# Altium schematic sheet HM-10.schDoc: HM-10 (BLE) Wiring
size A; Date: 3/13/2021; Author: Jesse Fernandez; CompanyName: GVSU; DrawnBy: Jesse Fernandez; Organization: Kennedy Hall of Engineering; Address1: 301 Fulton St. W; Address2: Grand Rapids, MI 49504; DocumentNumber: 1; Revision: 0.1; SheetNumber: 6; SheetTotal: 7; Time: 5:42 am
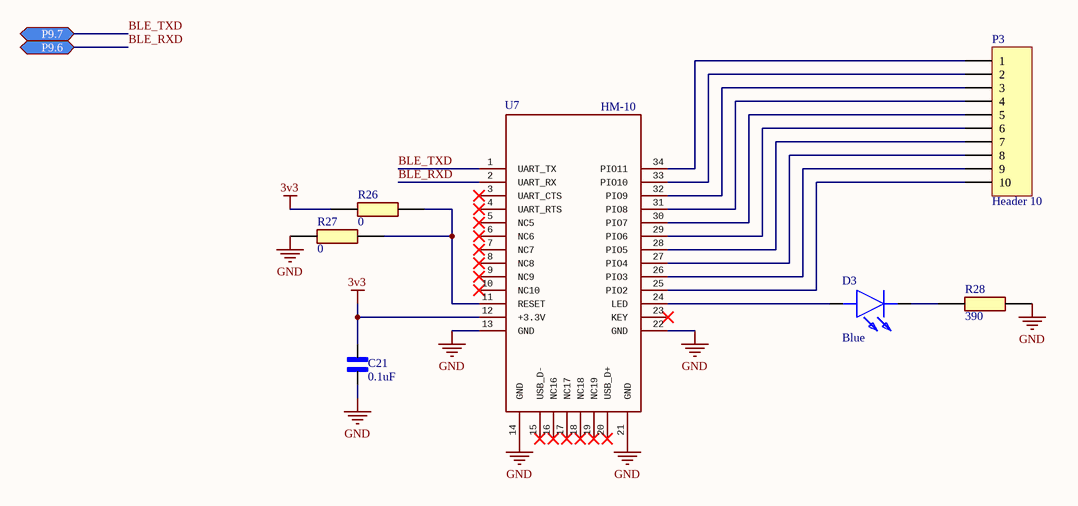
[diagram p0: HM-10.schDoc]

## Parts
C21  value 0.1uF  [CAPC1005X55N]  (hidden comment: Multilayer Ceramic Cap. 0402 (1005 Metric))
D3  Color: Blue  [APHHS1005LQBC/D-V]  (hidden comment: APHHS1005LQBC/D-V)
P3  Header 10  [HDR1X10]
R26  value 0  [Resistor 0603]  (hidden comment: Resistor 0603)
R27  value 0  [Resistor 0603]  (hidden comment: Resistor 0603)
R28  value 390  [Thin-Film Resistor 0402 (1005 Metric)]  (hidden comment: Resistor 0402 (1005 Metric))
U7  HM-10  [HM-10]

## Ports
P9.6 (bidir), P9.7 (bidir)

## Nets
3v3: C21.2 R26.1 U7.12(+3.3V)
GND: C21.1 R27.1 R28.2 U7.13(GND) U7.14(GND) U7.21(GND) U7.22(GND)
BLE_RXD: U7.2(UART_RX) ; port P9.6
BLE_TXD: U7.1(UART_TX) ; port P9.7
NetD3_1: D3.1(K) R28.1
NetD3_2: D3.2(A) U7.24(LED)
NetP3_1: P3.1 U7.34(PIO11)
NetP3_2: P3.2 U7.33(PIO10)
NetP3_3: P3.3 U7.32(PIO9)
NetP3_4: P3.4 U7.31(PIO8)
NetP3_5: P3.5 U7.30(PIO7)
NetP3_6: P3.6 U7.29(PIO6)
NetP3_7: P3.7 U7.28(PIO5)
NetP3_8: P3.8 U7.27(PIO4)
NetP3_9: P3.9 U7.26(PIO3)
NetP3_10: P3.10 U7.25(PIO2)
NetR26_2: R26.2 R27.2 U7.11(RESET)

Not connected (* = marked no-connect by the designer): U7 3(UART_CTS)* 4(UART_RTS)* 5(NC5)* 6(NC6)* 7(NC7)* 8(NC8)* 9(NC9)* 10(NC10)* 15(USB_D-)* 16(NC16)* 17(NC17)* 18(NC18)* 19(NC19)* 20(USB_D+)* 23(KEY)*

## Notes on the sheet
- Title
- Size:
- Date:
- A
- Number:
- Time:
- Revision:
- Sheet
- of
- Engineer:
- File:

## Library data of the parts
C21 = Multilayer Ceramic Cap. 0402 (1005 Metric): Capacitor X7R 0402 (1005 Metric); Manufacturer: AVX; Manufacturer P/N: 0402YC104JAT2A; Vendor: Mouser; Vendor P/N: 581-0402YC104JAT2A; Tolerance: 5%; Price: $0.72; ComponentLink1Description: Datasheet; ComponentLink1URL: *
D3 = APHHS1005LQBC/D-V: BLUE - Standard LEDs - SMD 1.0X0.5MM; Manufacturer: Kingbright; Vendor: Mouser; Vendor P/N: 604-APHHS1005LQBC/DV; V_forward: 2.65 [V]; I_forward: 2 [mA]; Manufacturer P/N: APHHS1005LQBC/D-V; Price: $0.56; ComponentLink1Description: Datasheet; ComponentLink1URL: https://www.mouser.com/datasheet/2/216/APHHS1005LQBC_D_V-1660377.pdf
P3 = Header 10: Header, 10-Pin; LatestRevisionDate: 17-Jul-2002; LatestRevisionNote: Re-released for DXP Platform.; Publisher: Altium Limited
R26 R27 = Resistor 0603: Manufacturer: Vishay / Dale; Manufacturer P/N: CRCW06030000Z0EA; Vendor: Mouser; Vendor P/N: 71-CRCW0603-0-E3; Tolerance: *tolerance*; Price: $0.10
R28 = Resistor 0402 (1005 Metric): Resistor, 0402 Package size; Manufacturer: Yageo; Manfacturer P/N: RC0402FR-07390RL; Vendor: Mouser; Vendor P/N: 603-RC0402FR-07390RL; Tolerance: 1%; Price: $0.10; ComponentLink1Description: Datasheet; ComponentLink1URL: *
U7 = HM-10: BLE Communication module, send/receive communications via UART; Manufacturer: DSD Tech; Vendor: Amazon; Manufacturer P/N: HM-10; Vendor P/N: HM-10; Price: $7.99; ComponentLink1Description: Datahseet; ComponentLink1URL: https://people.ece.cornell.edu/land/courses/ece4760/PIC32/uart/HM10/DSD%20TECH%20HM-10%20datasheet.pdf; ComponentLink2Description: Purchase Link; ComponentLink2URL: https://www.amazon.com/gp/product/B07589XCVN/ref=ppx_yo_dt_b_asin_title_o00_s00?ie=UTF8&psc=1